# EasyEDA schematic LM471-2-feb-15.json
TITLE: Sheet_1; REV: 1.0; Date: 2024-01-02; Sheet: 1/1; Company: Your Company
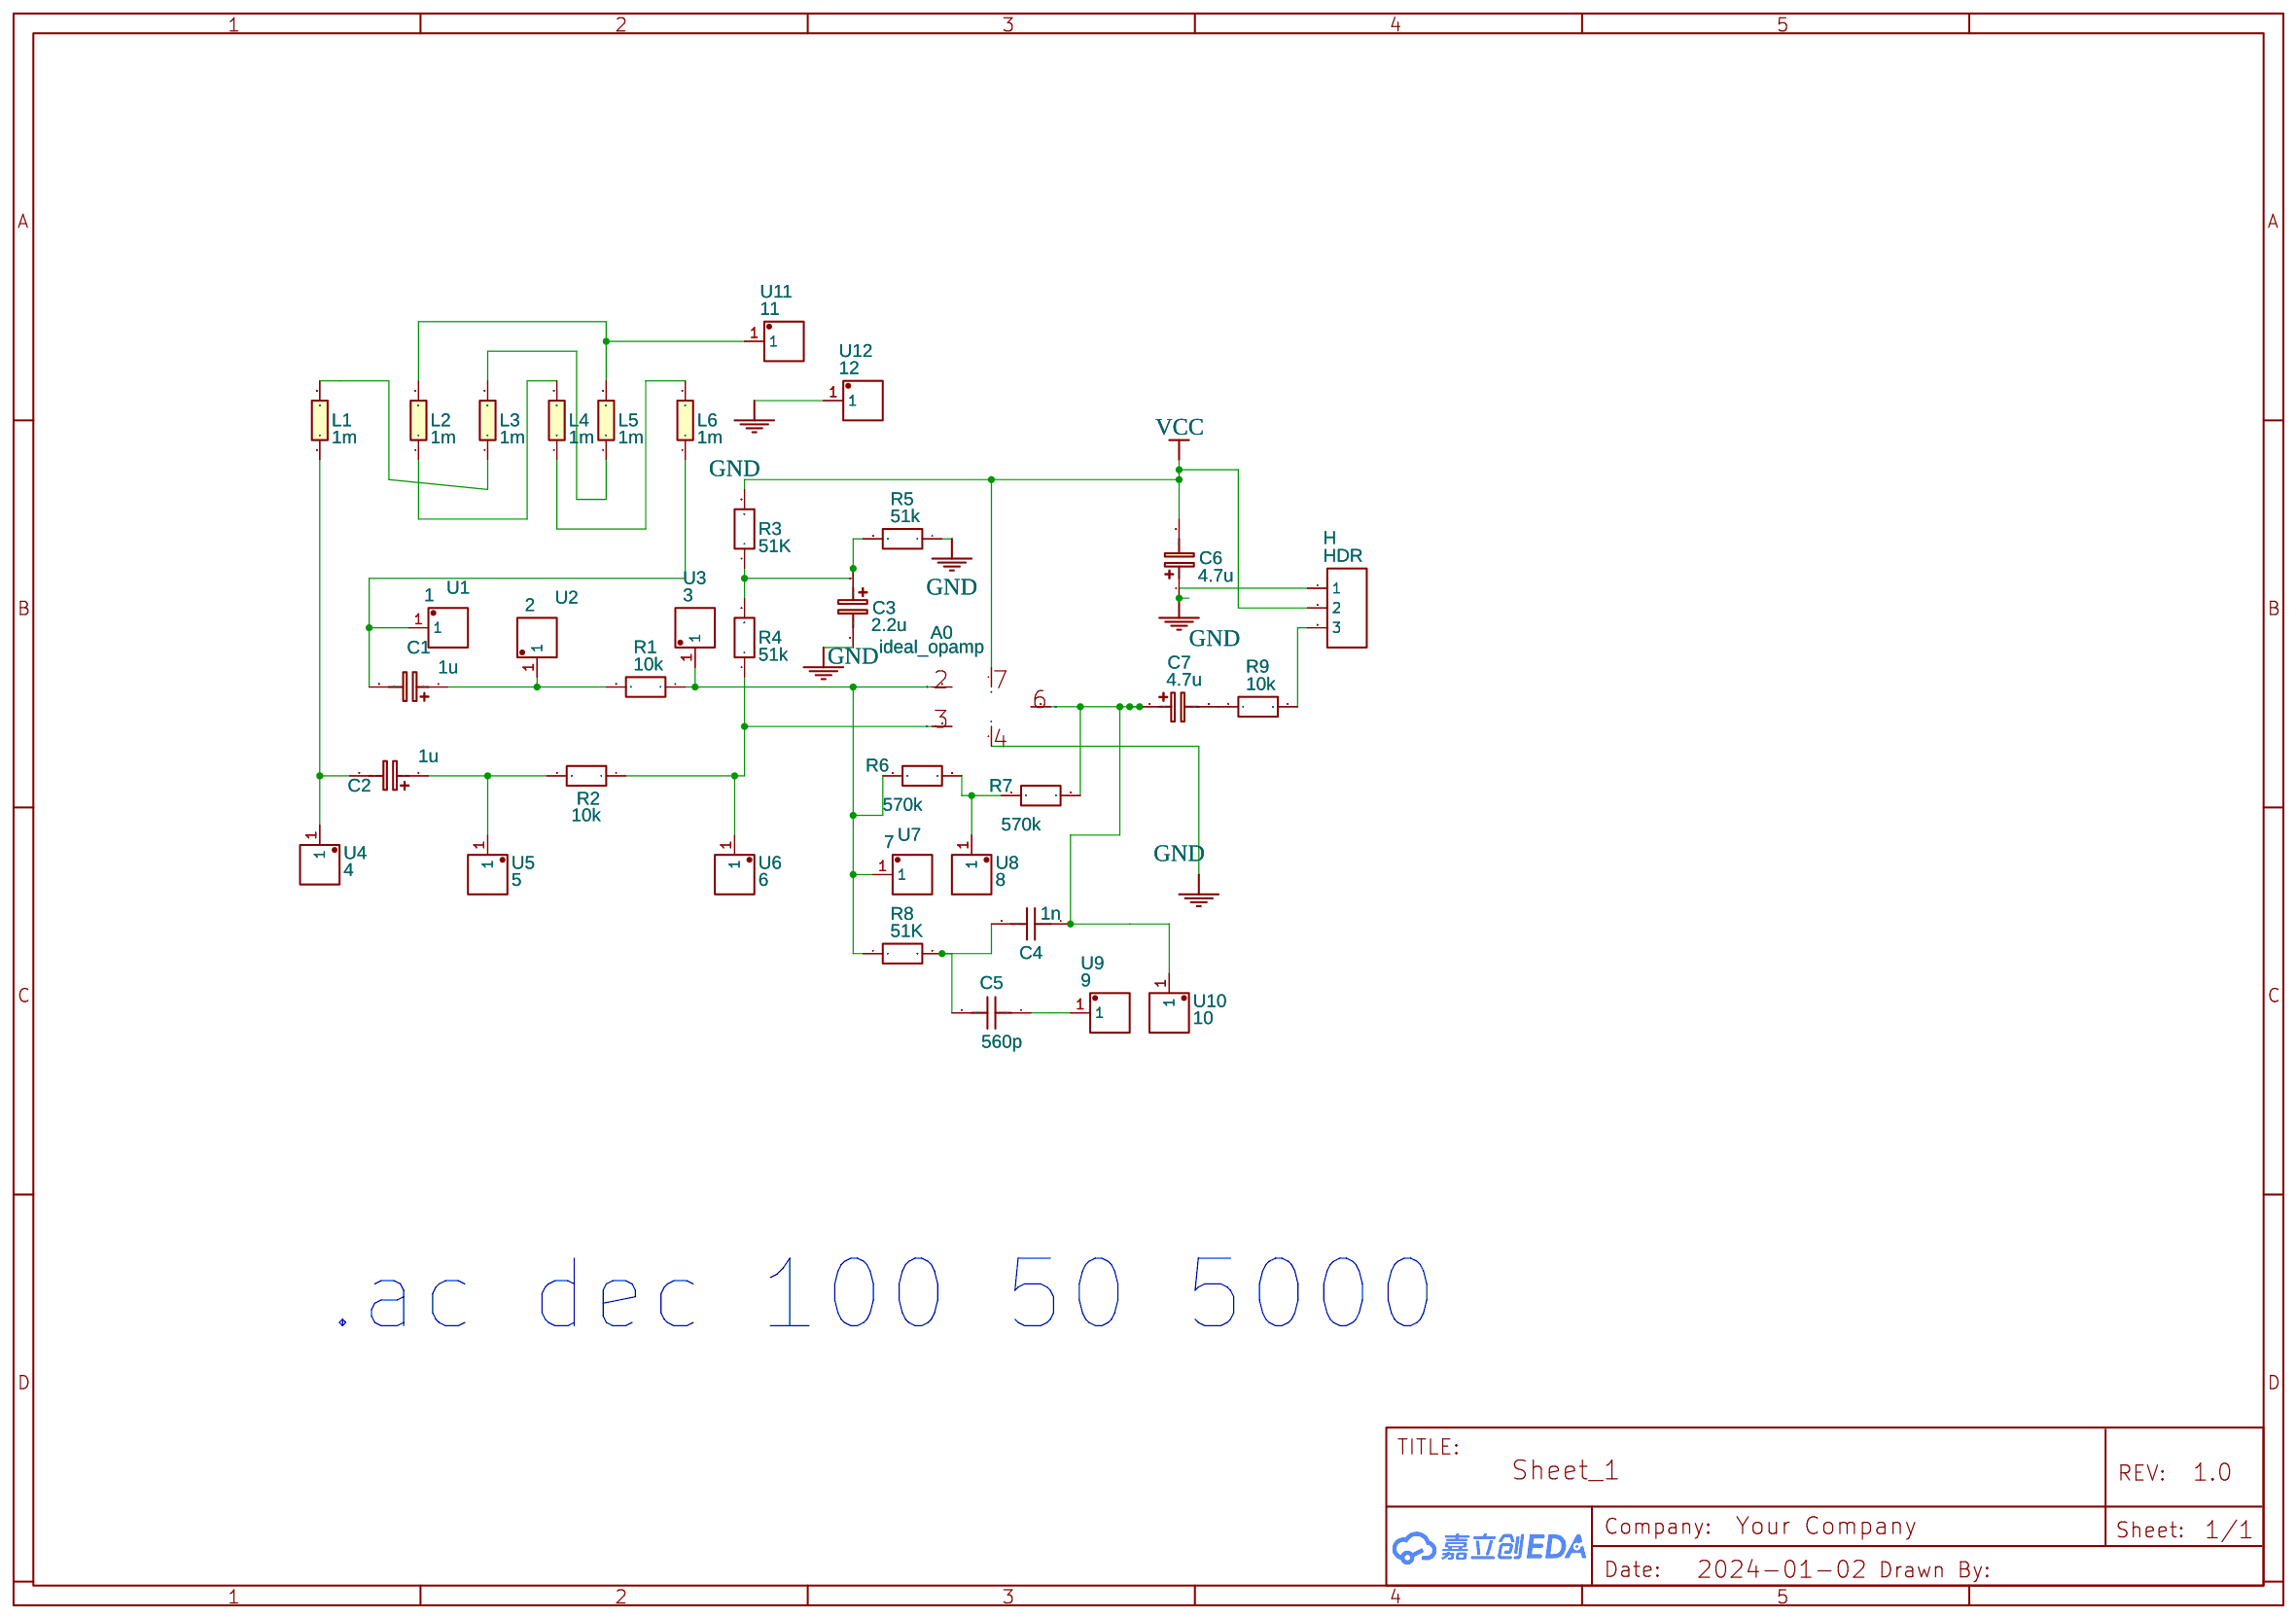
[diagram p0: schematic sheet]

## Parts
A0  ideal_opamp  [TL071H]
C1  1u  [CAPACITOR_SMD0805_HANDSOLDERING_REVA_DATE21JUN2010]
C2  1u  [CAPACITOR_SMD0805_HANDSOLDERING_REVA_DATE21JUN2010]
C3  2.2u  [CAPACITOR_SMD0805_HANDSOLDERING_REVA_DATE21JUN2010]
C4  1n  [CAPACITOR_SMD0805_HANDSOLDERING_REVA_DATE21JUN2010]
C5  560p  [CAPACITOR_SMD0805_HANDSOLDERING_REVA_DATE21JUN2010]
C6  4.7u  [CAPACITOR_SMD0805_HANDSOLDERING_REVA_DATE21JUN2010]
C7  4.7u  [CAPACITOR_SMD0805_HANDSOLDERING_REVA_DATE21JUN2010]
H  HDR  [HDR-F-2.54_1X3]
L1  1m  [L_COILCRAFT_XAL5030]
L2  1m  [L_COILCRAFT_XAL5030]
L3  1m  [L_COILCRAFT_XAL5030]
L4  1m  [L_COILCRAFT_XAL5030]
L5  1m  [L_COILCRAFT_XAL5030]
L6  1m  [L_COILCRAFT_XAL5030]
R1  10k  [R0603]
R2  10k  [R0603]
R3  51K  [R0603]
R4  51k  [R0603]
R5  51k  [R0603]
R6  570k  [R0603]
R7  570k  [R0603]
R8  51K  [R0603]
R9  10k  [R0603]
U1  1  [TEST-TH_BD2.54-P1.39]
U2  2  [TEST-TH_BD2.54-P1.39]
U3  3  [TEST-TH_BD2.54-P1.39]
U4  4  [TEST-TH_BD2.54-P1.39]
U5  5  [TEST-TH_BD2.54-P1.39]
U6  6  [TEST-TH_BD2.54-P1.39]
U7  7  [TEST-TH_BD2.54-P1.39]
U8  8  [TEST-TH_BD2.54-P1.39]
U9  9  [TEST-TH_BD2.54-P1.39]
U10  10  [TEST-TH_BD2.54-P1.39]
U11  11  [TEST-TH_BD2.54-P1.39]
U12  12  [TEST-TH_BD2.54-P1.39]

## Library data of the parts
A0 = LM741: Contributor: juan_g2; sim: true
C1-C3 C6 C7 = C_Tan_SMD_A_EU: Contributor: LCEDA_Lib
C4 C5 = Capacitor_US: Contributor: EasyEDA; Supplier: YUJING; Capacitance: 1u
H = HDR-F-2.54_1x3: Supplier Part: C146690; Supplier: LCSC; Contributor: LCEDA_Lib
L1-L6 = L0603_EU: Contributor: LCEDA_Lib
R1-R9 = R_0603_EU: Contributor: LCEDA_Lib
U1-U12 = 5001: Contributor: LCSC; Supplier: LCSC; Supplier Part: C238122; Manufacturer: Keystone; JLCPCB Part Class: Extended Part

## Nets
GND: A0.4(V-) C3.2 C6.1 H.1 R5.1 U12.1
VCC: A0.7(V+) C6.2 H.2 R3.2
Net-(A0-2): A0.2(IN-) R1.1 R6.1 R8.1 U3.1 U7.1
Net-(A0-3): A0.3(IN+) R2.1 R4.1 U6.1
Net-(A0-6): A0.6(OUT) C4.1 C7.1 R7.2 U10.1
Net-(C1-1): C1.1 R1.2 U2.1
Net-(C1-2): C1.2 L6.1 U1.1
Net-(C2-1): C2.1 R2.2 U5.1
Net-(C2-2): C2.2 L1.1 U4.1
Net-(C3-1): C3.1 R3.1 R4.2 R5.2
Net-(C4-2): C4.2 C5.2 R8.2
Net-(C5-1): C5.1 U9.1
Net-(C7-2): C7.2 R9.1
Net-(H-3): H.3 R9.2
Net-(L1-2): L1.2 L3.1
Net-(L2-1): L2.1 L4.2
Net-(L2-2): L2.2 L5.2 U11.1
Net-(L3-2): L3.2 L5.1
Net-(L4-1): L4.1 L6.2
Net-(R6-2): R6.2 R7.1 U8.1

## Notes on the sheet
- .ac dec 100 50 5000
